# Altium schematic sheet nose_thermo.SchDoc
size A
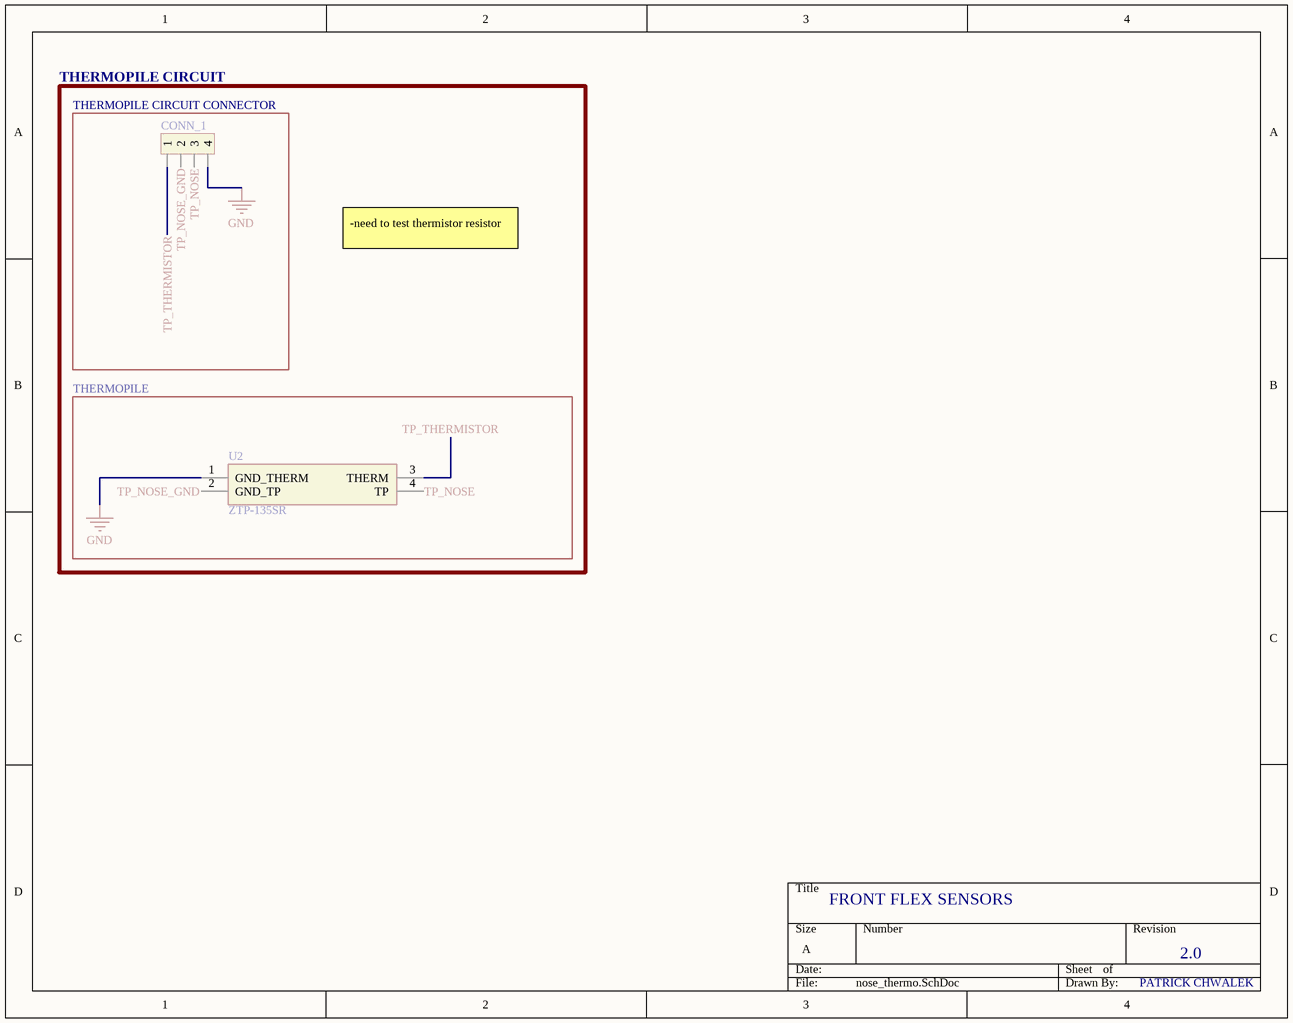
[diagram p0: nose_thermo.SchDoc]

## Parts
CONN_1  THERMO  [4_pos_1mm_header]  (value not drawn)
U2  ZTP-135SR  [ZTP-135SR]

## Blocks framed on the sheet
THERMOPILE CIRCUIT CONNECTOR: CONN_1
THERMOPILE: U2

## Nets
GND: CONN_1.4 U2.1(GND_THERM)
TP_NOSE: CONN_1.3 U2.4(TP)
TP_NOSE_GND: CONN_1.2 U2.2(GND_TP)
TP_THERMISTOR: CONN_1.1 U2.3(THERM)

## Notes on the sheet
- THERMOPILE CIRCUIT
- -need to test thermistor resistor
- FRONT FLEX SENSORS
- 2.0
- PATRICK CHWALEK

## Library data of the parts
CONN_1 = 4_pin_1mm_header
U2 = ZTP-135SR: Undefined or Miscellaneous; Manufacturer_Name: Amphenol Advanced Sensors; Allied_Number: 70282698; Datasheet Link: https://www.amphenol-sensors.com/en/component/edocman/370-thermopile-ir-sensor-applications/download?Itemid=7967; Manufacturer_Part_Number: ZTP-135SR; Mouser Part Number: 527-ZTP-135SR; Mouser Price/Stock: https://www.mouser.com/Search/Refine.aspx?Keyword=527-ZTP-135SR; Allied Price/Stock: https://www.alliedelec.com/amphenol-advanced-sensors-ztp-135sr/70282698/